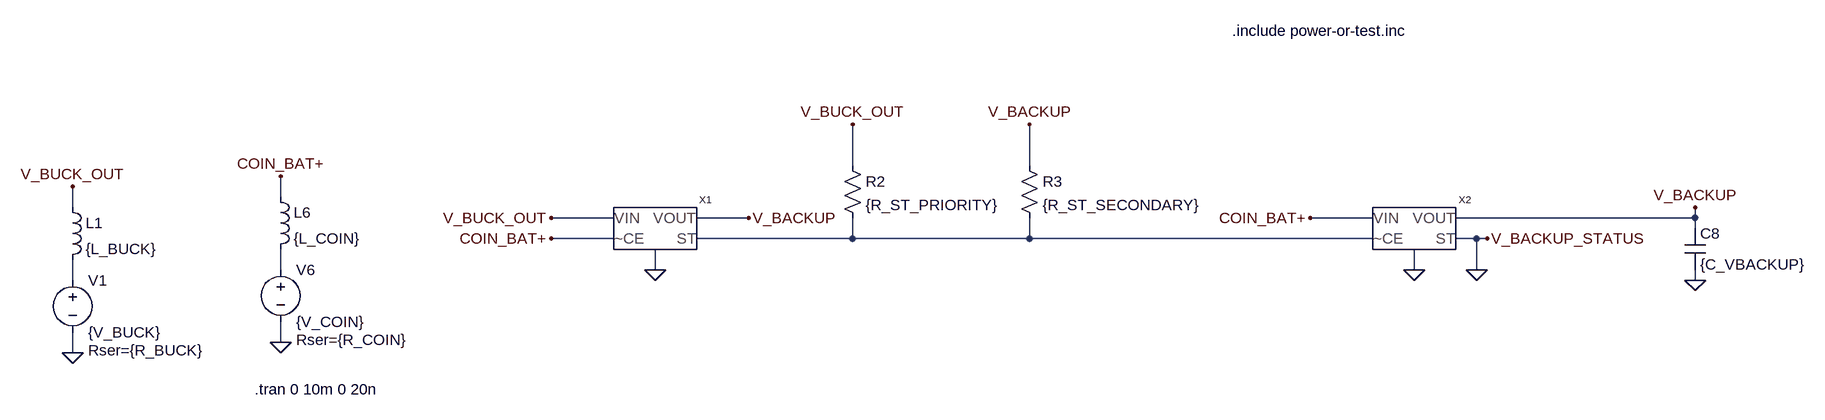
[diagram p0: schematic power-or-test.asc]
power-or-test.asc, the LTspice schematic file:
Version 4.1
SHEET 1 2496 1868
WIRE -544 800 -544 736
WIRE -272 800 -272 736
WIRE -1424 848 -1424 816
WIRE -1744 864 -1744 832
WIRE -912 880 -1008 880
WIRE -704 880 -784 880
WIRE 256 880 160 880
WIRE 752 880 752 864
WIRE 752 880 384 880
WIRE 752 896 752 880
WIRE -912 912 -1008 912
WIRE -544 912 -544 880
WIRE -544 912 -784 912
WIRE -272 912 -272 880
WIRE -272 912 -544 912
WIRE 256 912 -272 912
WIRE 416 912 384 912
WIRE 432 912 416 912
WIRE -1424 960 -1424 928
WIRE -848 960 -848 928
WIRE 320 960 320 928
WIRE 416 960 416 912
WIRE -1744 976 -1744 944
WIRE 752 976 752 960
WIRE -1424 1072 -1424 1040
WIRE -1744 1088 -1744 1056
FLAG -1424 1072 0
FLAG -1424 816 COIN_BAT+
FLAG -1008 912 COIN_BAT+
FLAG -1008 880 V_BUCK_OUT
FLAG -704 880 V_BACKUP
FLAG -848 960 0
FLAG 320 960 0
FLAG 160 880 COIN_BAT+
FLAG -272 736 V_BACKUP
FLAG -544 736 V_BUCK_OUT
FLAG 432 912 V_BACKUP_STATUS
FLAG 752 976 0
FLAG 752 864 V_BACKUP
FLAG 416 960 0
FLAG -1744 1088 0
FLAG -1744 832 V_BUCK_OUT
SYMBOL voltage -1424 944 R0
WINDOW 123 0 0 Left 0
WINDOW 39 24 124 Left 2
SYMATTR SpiceLine Rser={R_COIN}
SYMATTR InstName V6
SYMATTR Value {V_COIN}
SYMBOL ind -1440 832 R0
SYMATTR InstName L6
SYMATTR Value {L_COIN}
SYMATTR SpiceLine Rser=1m
SYMBOL LM66100 -864 896 R0
SYMATTR InstName X1
SYMBOL LM66100 304 896 R0
SYMATTR InstName X2
SYMBOL res -560 784 R0
SYMATTR InstName R2
SYMATTR Value {R_ST_PRIORITY}
SYMBOL res -288 784 R0
SYMATTR InstName R3
SYMATTR Value {R_ST_SECONDARY}
SYMBOL cap 736 896 R0
SYMATTR InstName C8
SYMATTR Value {C_VBACKUP}
SYMBOL voltage -1744 960 R0
WINDOW 123 0 0 Left 0
WINDOW 39 24 124 Left 2
SYMATTR SpiceLine Rser={R_BUCK}
SYMATTR InstName V1
SYMATTR Value {V_BUCK}
SYMBOL ind -1760 848 R0
SYMATTR InstName L1
SYMATTR Value {L_BUCK}
SYMATTR SpiceLine Rser=1m
TEXT 40 592 Left 2 !.include power-or-test.inc
TEXT -1464 1144 Left 2 !.tran 0 10m 0 20n

The netlist it stands for:
* power-or-test.asc
V6 N002 0 {V_COIN} Rser={R_COIN}
L6 COIN_BAT+ N002 {L_COIN} Rser=1m
X§X1 V_BUCK_OUT V_BACKUP COIN_BAT+ N001 0 LM66100  ; pins VIN VOUT CE ST G
X§X2 COIN_BAT+ V_BACKUP N001 0 0 LM66100  ; pins VIN VOUT CE ST G
R2 V_BUCK_OUT N001 {R_ST_PRIORITY}
R3 V_BACKUP N001 {R_ST_SECONDARY}
C8 V_BACKUP 0 {C_VBACKUP}
V1 N003 0 {V_BUCK} Rser={R_BUCK}
L1 V_BUCK_OUT N003 {L_BUCK} Rser=1m
.include power-or-test.inc
.tran 0 10m 0 20n
.backanno
.end